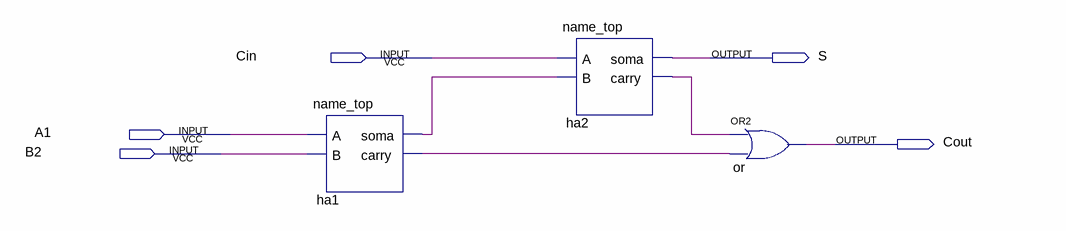
[diagram p0: schematic sheet]
// Quartus schematic full_adder.bdf as structural Verilog: 3 symbols, 5 pins
module full_adder (
  input  Cin,
  input  A1,
  input  B2,
  output S,
  output Cout
);

  wire ha1_carry, ha1_soma, ha2_carry;

  name_top ha1 (.A(A1), .B(B2), .soma(ha1_soma), .carry(ha1_carry));
  name_top ha2 (.A(Cin), .B(ha1_soma), .soma(S), .carry(ha2_carry));
  or \or  (Cout, ha2_carry, ha1_carry);
endmodule
